# Altium project BLDC_ctrl.PrjPcb
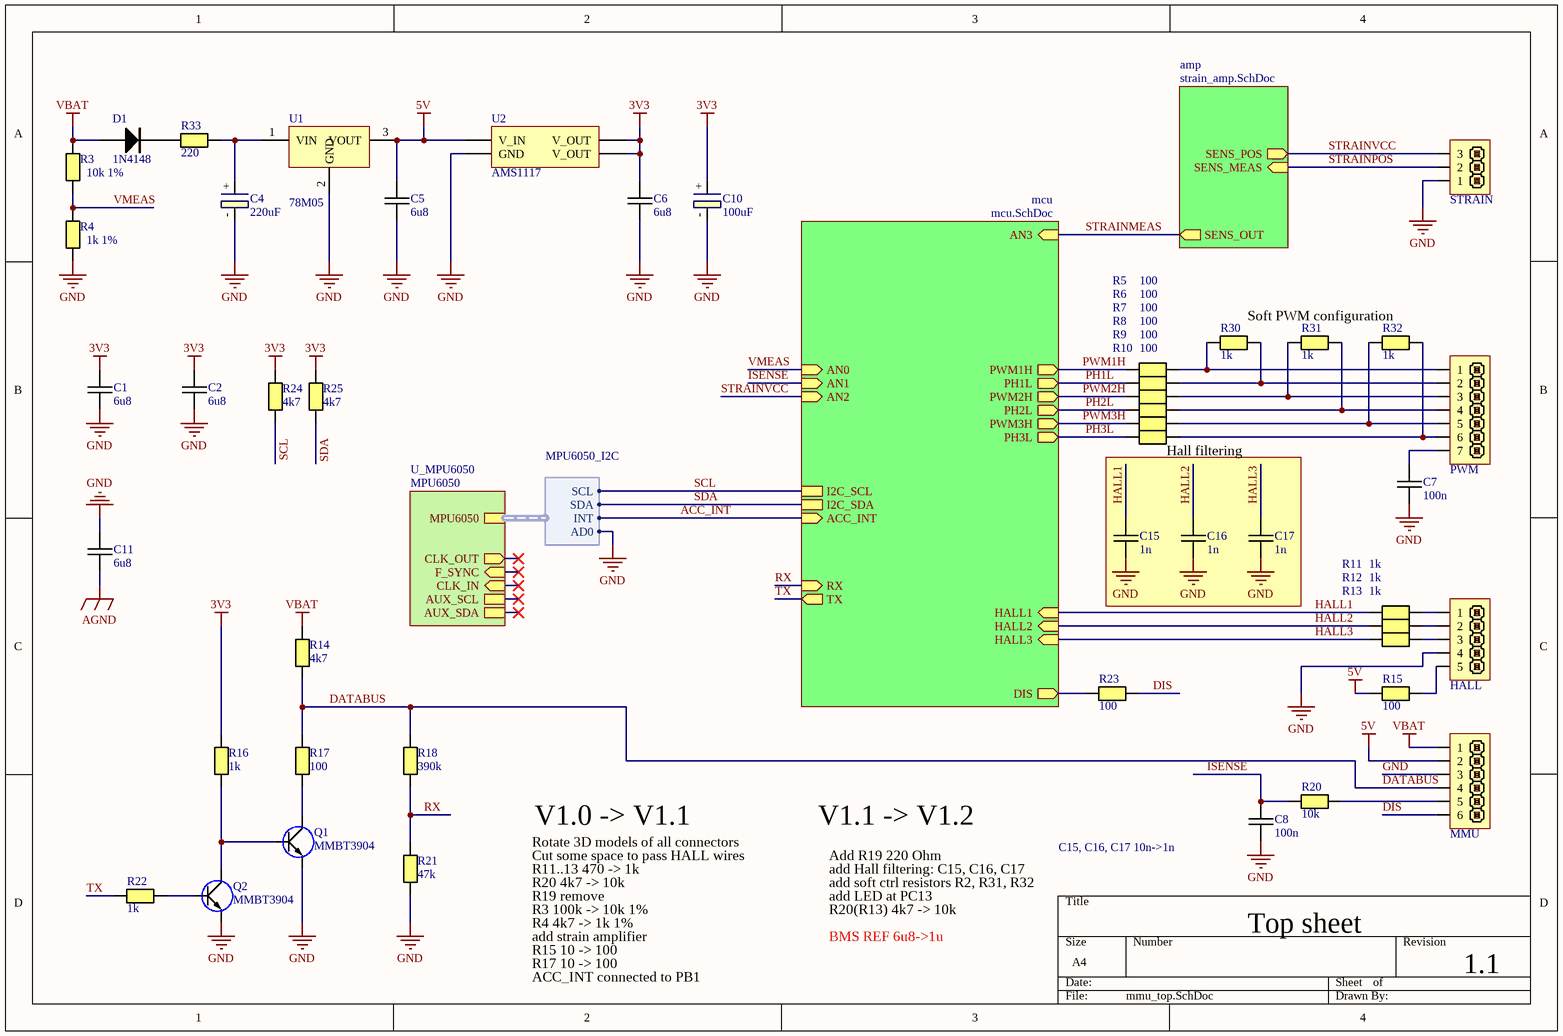
[diagram p0: mmu_top.SchDoc]
3 sheets, 64 parts. Net scope: hierarchical (ports join the sheet entries above them; power ports are global).
Board file: mmu_pcb_v1.2.PcbDoc
Sheets:
  mmu_top.SchDoc
    mcu = mcu.SchDoc
    amp = strain_amp.SchDoc

## Sheet mmu_top.SchDoc
size A4; SheetNumber: 1; SheetTotal: 4

### Parts
(Parts that share a designator on the sheet are numbered #1, #2 ... from top to bottom, then left to right.)
C1  6u8  [CAPC0805(2012)75_N]
C2  6u8  [CAPC0805(2012)75_N]
C4  220uF  [10x10.5 Capacitor]
C5  6u8  [CAPC0805(2012)75_N]
C6  6u8  [CAPC0805(2012)75_N]
C7  100n  [CAPC0603(1608)55_N]
C8  100n  [CAPC0603(1608)55_N]
C10  100uF  [TC7343]
C11  6u8  [CAPC0805(2012)75_N]
C15  1n  [CAPC0603(1608)55_N]
C16  1n  [CAPC0603(1608)55_N]
C17  1n  [CAPC0603(1608)55_N]
D1  1N4148  [SOD80]
HALL  PIN HEADER 1x5  [XH2.54 5P]  (value not drawn)
MMU  PIN HEADER 1x6  [XH2.54 6P]  (value not drawn)
PWM  PIN HEADER 1x7  [XH2.54 7P]  (value not drawn)
Q1  MMBT3904  [SOT23]
Q2  MMBT3904  [SOT23]
R3  10k 1%  [RESC0603(1608)_N]
R4  1k 1%  [RESC0603(1608)_N]
R5  100  [RESC0603(1608)_N]
R6  100  [RESC0603(1608)_N]
R7  100  [RESC0603(1608)_N]
R8  100  [RESC0603(1608)_N]
R9  100  [RESC0603(1608)_N]
R10  100  [RESC0603(1608)_N]
R11  1k  [RESC0603(1608)_N]
R12  1k  [RESC0603(1608)_N]
R13  1k  [RESC0603(1608)_N]
R14  4k7  [RESC0603(1608)_N]
R15  100  [RESC0603(1608)_N]
R16  1k  [RESC0603(1608)_N]
R17  100  [RESC0603(1608)_N]
R18  390k  [RESC0603(1608)_N]
R20  10k  [RESC0603(1608)_N]
R21  47k  [RESC0603(1608)_N]
R22  1k  [RESC0603(1608)_N]
R23  100  [RESC0603(1608)_N]
R24  4k7  [RESC0603(1608)_N]
R25  4k7  [RESC0603(1608)_N]
R30#1  1k  [RESC0603(1608)_N]
R31  1k  [RESC0603(1608)_N]
R32  1k  [RESC0603(1608)_N]
R33  220  [RESC2512(6432)_N]
STRAIN  PIN HEADER 1x3  [XH2.54 3P]  (value not drawn)
U1  78M05  [TO-252]
U2  AMS1117  [SOT229P700X180-4N]

### Blocks framed on the sheet
Hall filtering: C15-C17

### Sub-sheets
amp = strain_amp.SchDoc: SENS_OUT (out), SENS_POS (out), SENS_MEAS (in)
mcu = mcu.SchDoc: PWM1H (out), PWM3H (out), PH3L (out), PWM2H (out), DIS (out), PH2L (out), PH1L (out), RX (in), TX (out), AN2 (in), AN1 (in), HALL3 (in), AN3 (in), HALL2 (in), AN0 (in), HALL1 (in), I2C_SCL, I2C_SDA, ACC_INT (in)
U_MPU6050 = MPU6050 (file not in this document): MPU6050 (harness MPU6050_I2C), CLK_OUT (out), F_SYNC (in), CLK_IN (in), AUX_SCL, AUX_SDA

### Harnesses
MPU6050_I2C: AD0, INT, SCL, SDA

### Nets
3V3: C1.1 C2.1 C6.1 C10.+ R16.2 R24.2 R25.2 U2.2(V_OUT) U2.4(V_OUT)
5V: C5.1 MMU.2 R15.1 U1.3(VOUT) U2.3(V_IN)
AGND: C11.2
GND: C1.2 C2.2 C4.- C5.2 C6.2 C7.2 C8.2 C10.- C11.1 C15.2 C16.2 C17.2 HALL.4 MMU.3 Q1.2(E) Q2.2(E) R4.1 R21.1 STRAIN.1 U1.2(GND) U2.1(GND) ; sheet U_MPU6050/MPU6050.AD0
VBAT: D1.1(A) MMU.1 R3.2 R14.2
ACC_INT: sheet mcu/ACC_INT, sheet U_MPU6050/MPU6050.INT
DATABUS: MMU.4 R14.1 R17.2 R18.2
DIS: MMU.6 R23.2
HALL1: C15.1 R11.1 ; sheet mcu/HALL1
HALL2: C16.1 R12.1 ; sheet mcu/HALL2
HALL3: C17.1 R13.1 ; sheet mcu/HALL3
ISENSE: C8.1 R20.1 ; sheet mcu/AN1
PH1L: R6.1 ; sheet mcu/PH1L
PH2L: R8.1 ; sheet mcu/PH2L
PH3L: R10.1 ; sheet mcu/PH3L
PWM1H: R5.1 ; sheet mcu/PWM1H
PWM2H: R7.1 ; sheet mcu/PWM2H
PWM3H: R9.1 ; sheet mcu/PWM3H
RX: R18.1 R21.2 ; sheet mcu/RX
SCL: R24.1 ; sheet mcu/I2C_SCL, sheet U_MPU6050/MPU6050.SCL
SDA: R25.1 ; sheet mcu/I2C_SDA, sheet U_MPU6050/MPU6050.SDA
STRAINMEAS: sheet mcu/AN3, sheet amp/SENS_OUT  [project net OP_OUT_F]
STRAINPOS: STRAIN.2 ; sheet amp/SENS_MEAS  [project net SENS_MEAS]
STRAINVCC: STRAIN.3 ; sheet mcu/AN2, sheet amp/SENS_POS  [project net SENS_POS]
TX: R22.1 ; sheet mcu/TX
VMEAS: R3.1 R4.2 ; sheet mcu/AN0
NetC4_+: C4.+ R33.2 U1.1(VIN)
NetC7_1: C7.1 PWM.7
NetD1_2: D1.2(K) R33.1
NetHALL_1: HALL.1 R11.2
NetHALL_2: HALL.2 R12.2
NetHALL_3: HALL.3 R13.2
NetHALL_5: HALL.5 R15.2
NetMMU_5: MMU.5 R20.2
NetPWM_1: PWM.1 R5.2 R30#1.1
NetPWM_2: PWM.2 R6.2 R30#1.2
NetPWM_3: PWM.3 R7.2 R31.1
NetPWM_4: PWM.4 R8.2 R31.2
NetPWM_5: PWM.5 R9.2 R32.1
NetPWM_6: PWM.6 R10.2 R32.2
NetQ1_1: Q1.1(B) Q2.3(C) R16.1
NetQ1_3: Q1.3(C) R17.1
NetQ2_1: Q2.1(B) R22.2
NetR23_1: R23.1 ; sheet mcu/DIS

### Notes on the sheet
- Soft PWM configuration
- Rotate 3D models of all connectors
- Cut some space to pass HALL wires
- V1.0 -> V1.1
- Add R19 220 Ohm
- V1.1 -> V1.2
- C15, C16, C17 10n->1n
- R11..13 470 -> 1k
- R20 4k7 -> 10k
- R19 remove
- R3 100k -> 10k 1%
- R4 4k7 -> 1k 1%
- add Hall filtering: C15, C16, C17
- add soft ctrl resistors R2, R31, R32
- add LED at PC13
- R20(R13) 4k7 -> 10k
- Top sheet
- add strain amplifier
- R15 10 -> 100
- R17 10 -> 100
- ACC_INT connected to PB1
- BMS REF 6u8->1u
- 1.1

### Library data of the parts
C1 C2 C5-C8 C11 C15-C17 = Capacitor M: Ceramic capacitor Medium density
  C1 C2 C5 C6 C11: Value: 6u8
  C7 C8: Value: 100n
  C15-C17: Value: 1n
C4 C10 = Capacitor Electrolitic
  C4: Value: 220uF
  C10: Value: 100uF
D1 = 1N4148: Small Signal Fast Switching Diodes; Repetitive peak reverse voltage: 100 V; Reverse voltage: 75 V; Peak forward surge current: 2 A; Repetitive peak forward current: 500 mA; Forward continuous current: 300 mA; Average forward current: 150 mA; Diode capacitance: 4 pF; Reverse recovery time: 4 ~ 8 ns; Supplier 1: Mouser; Supplier Part Number 1: 78-MCL4148
HALL = PIN HEADER 2.54 1x5
MMU = PIN HEADER 2.54 1x6
PWM = PIN HEADER 2.54 1x7
Q1 Q2 = 2N3904: NPN General Purpose Transistor; Collector-Emitter Voltage: 40V; Collector-Base Voltage: 60V; Collector Current - Continuous: 200mA; DC Current Gain: 300
R3-R18 R20-R25 R30#1 R31-R33 = Resistor M: Resistor Medium Density
  R3: Value: 10k 1%
  R4: Value: 1k 1%
  R5-R10 R15 R17 R23: Value: 100
  R11-R13 R16 R22 R30#1 R31 R32: Value: 1k
  R14 R24 R25: Value: 4k7
  R18: Value: 390k
  R20: Value: 10k
  R21: Value: 47k
  R33: Value: 220
STRAIN = PIN HEADER 2.54 1x3
U1 = 78M05: Linear Voltage Regulator; DC Input Voltage MAX: 30V; Output Current: 300..700mA
U2 = AMS1117: 800mA LDO  15V max

## Sheet mcu.SchDoc
size A4; SheetNumber: 2; SheetTotal: 4
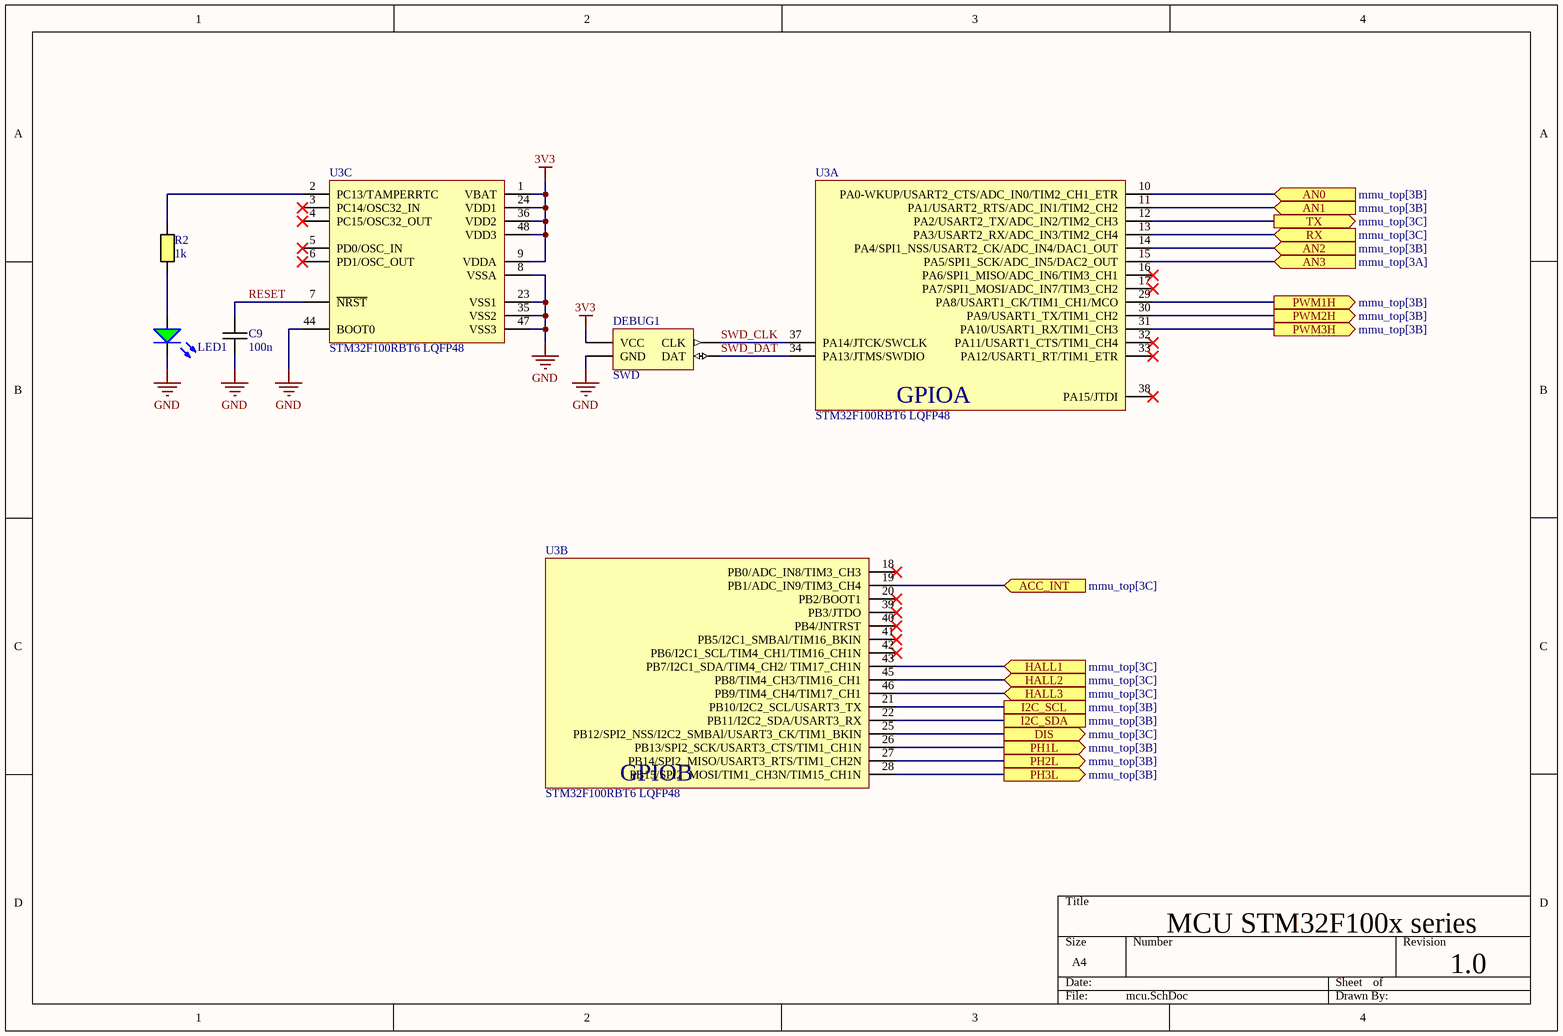
[diagram p1: mcu.SchDoc]

### Parts
C9  100n  [CAPC0603(1608)55_N]
DEBUG1  SWD  [PIN HEADER SINGLE 4]
LED1  1206 LED GREEN  [1206 LED GREEN]  (value not drawn)
R2  1k  [RESC0603(1608)_N]
U3  STM32F100RBT6 LQFP48  [LQFP48]  (parts A,B,C of 3)

### Ports
ACC_INT (in, see mmu_top[3C]), AN0 (in, see mmu_top[3B]), AN1 (in, see mmu_top[3B]), AN2 (in, see mmu_top[3B]), AN3 (in, see mmu_top[3A]), DIS (out, see mmu_top[3C]), HALL1 (in, see mmu_top[3C]), HALL2 (in, see mmu_top[3C]), HALL3 (in, see mmu_top[3C]), I2C_SCL (see mmu_top[3B]), I2C_SDA (see mmu_top[3B]), PH1L (out, see mmu_top[3B]), PH2L (out, see mmu_top[3B]), PH3L (out, see mmu_top[3B]), PWM1H (out, see mmu_top[3B]), PWM2H (out, see mmu_top[3B]), PWM3H (out, see mmu_top[3B]), RX (in, see mmu_top[3C]), TX (out, see mmu_top[3C])

### Nets
3V3: DEBUG1.1(VCC) U3.1(VBAT) U3.9(VDDA) U3.24(VDD1) U3.36(VDD2) U3.48(VDD3)
GND: C9.2 DEBUG1.3(GND) LED1.K U3.8(VSSA) U3.23(VSS1) U3.35(VSS2) U3.44(BOOT0) U3.47(VSS3)
ACC_INT: U3.19(PB1/ADC_IN9/TIM3_CH4) ; port ACC_INT
HALL1: U3.43(PB7/I2C1_SDA/TIM4_CH2/_TIM17_CH1N) ; port HALL1
HALL2: U3.45(PB8/TIM4_CH3/TIM16_CH1) ; port HALL2
HALL3: U3.46(PB9/TIM4_CH4/TIM17_CH1) ; port HALL3
ISENSE: U3.11(PA1/USART2_RTS/ADC_IN1/TIM2_CH2) ; port AN1
OP_OUT_F: U3.15(PA5/SPI1_SCK/ADC_IN5/DAC2_OUT) ; port AN3
PH1L: U3.26(PB13/SPI2_SCK/USART3_CTS/TIM1_CH1N) ; port PH1L
PH2L: U3.27(PB14/SPI2_MISO/USART3_RTS/TIM1_CH2N) ; port PH2L
PH3L: U3.28(PB15/SPI2_MOSI/TIM1_CH3N/TIM15_CH1N) ; port PH3L
PWM1H: U3.29(PA8/USART1_CK/TIM1_CH1/MCO) ; port PWM1H
PWM2H: U3.30(PA9/USART1_TX/TIM1_CH2) ; port PWM2H
PWM3H: U3.31(PA10/USART1_RX/TIM1_CH3) ; port PWM3H
RESET: C9.1 U3.7(~{NRST})
RX: U3.13(PA3/USART2_RX/ADC_IN3/TIM2_CH4) ; port RX
SCL: U3.21(PB10/I2C2_SCL/USART3_TX) ; port I2C_SCL
SDA: U3.22(PB11/I2C2_SDA/USART3_RX) ; port I2C_SDA
SENS_POS: U3.14(PA4/SPI1_NSS/USART2_CK/ADC_IN4/DAC1_OUT) ; port AN2
SWD_CLK: DEBUG1.2(CLK) U3.37(PA14/JTCK/SWCLK)
SWD_DAT: DEBUG1.4(DAT) U3.34(PA13/JTMS/SWDIO)
TX: U3.12(PA2/USART2_TX/ADC_IN2/TIM2_CH3) ; port TX
VMEAS: U3.10(PA0-WKUP/USART2_CTS/ADC_IN0/TIM2_CH1_ETR) ; port AN0
NetLED1_A: LED1.A R2.1
NetR2_2: R2.2 U3.2(PC13/TAMPERRTC)
NetR23_1: U3.25(PB12/SPI2_NSS/I2C2_SMBAl/USART3_CK/TIM1_BKIN) ; port DIS

Not connected (* = marked no-connect by the designer): U3 3(PC14/OSC32_IN)* 4(PC15/OSC32_OUT)* 5(PD0/OSC_IN)* 6(PD1/OSC_OUT)* 16(PA6/SPI1_MISO/ADC_IN6/TIM3_CH1)* 17(PA7/SPI1_MOSI/ADC_IN7/TIM3_CH2)* 18(PB0/ADC_IN8/TIM3_CH3)* 20(PB2/BOOT1)* 32(PA11/USART1_CTS/TIM1_CH4)* 33(PA12/USART1_RT/TIM1_ETR)* 38(PA15/JTDI)* 39(PB3/JTDO)* 40(PB4/JNTRST)* 41(PB5/I2C1_SMBAl/TIM16_BKIN)* 42(PB6/I2C1_SCL/TIM4_CH1/TIM16_CH1N)*

### Notes on the sheet
- MCU STM32F100x series
- 1.0
- (in symbol STM32F100RBT6 LQFP48, part A) GPIOA
- (in symbol STM32F100RBT6 LQFP48, part B) GPIOB

### Library data of the parts
C9 = Capacitor M: Ceramic capacitor Medium density; Value: 100n
DEBUG1 = SWD DEBUG: SWD ST DEBUG
R2 = Resistor M: Resistor Medium Density; Value: 1k

## Sheet strain_amp.SchDoc
size A4; SheetNumber: 3; SheetTotal: 4
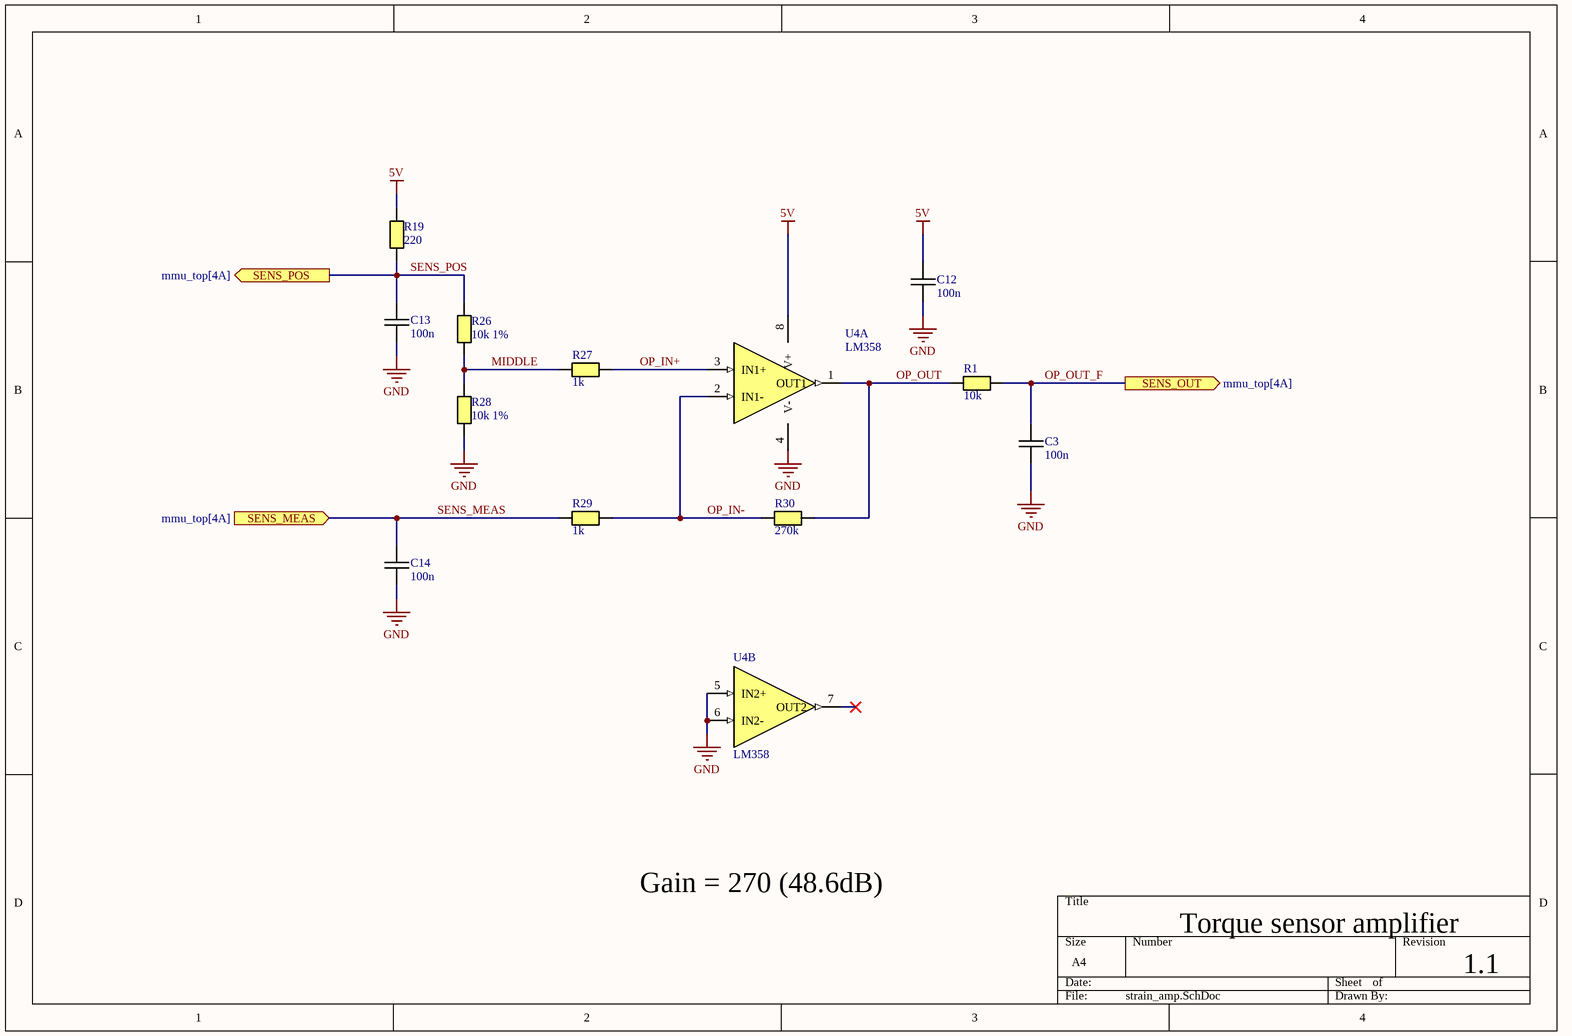
[diagram p2: strain_amp.SchDoc]

### Parts
(Parts that share a designator on the sheet are numbered #1, #2 ... from top to bottom, then left to right.)
C3  100n  [CAPC0603(1608)55_N]
C12  100n  [CAPC0603(1608)55_N]
C13  100n  [CAPC0603(1608)55_N]
C14  100n  [CAPC0603(1608)55_N]
R1  10k  [RESC0603(1608)_N]
R19  220  [RESC0603(1608)_N]
R26  10k 1%  [RESC0603(1608)_N]
R27  1k  [RESC0603(1608)_N]
R28  10k 1%  [RESC0603(1608)_N]
R29  1k  [RESC0603(1608)_N]
R30#2  270k  [RESC0603(1608)_N]
U4  LM358  [SO8]  (parts A,B of 2)

### Ports
SENS_MEAS (in, see mmu_top[4A]), SENS_OUT (out, see mmu_top[4A]), SENS_POS (out, see mmu_top[4A])

### Nets
5V: C12.1 R19.2 U4.8(V+)
GND: C3.2 C12.2 C13.2 C14.2 R28.1 U4.4(V-) U4.5(IN2+) U4.6(IN2-)
MIDDLE: R26.1 R27.1 R28.2
OP_IN+: R27.2 U4.3(IN1+)
OP_IN-: R29.2 R30#2.1 U4.2(IN1-)
OP_OUT: R1.1 R30#2.2 U4.1(OUT1)
OP_OUT_F: C3.1 R1.2 ; port SENS_OUT
SENS_MEAS: C14.1 R29.1 ; port SENS_MEAS
SENS_POS: C13.1 R19.1 R26.2 ; port SENS_POS

Not connected (* = marked no-connect by the designer): U4 7(OUT2)*

### Notes on the sheet
- Gain = 270 (48.6dB)
- Torque sensor amplifier
- 1.1

### Library data of the parts
C3 C12-C14 = Capacitor M: Ceramic capacitor Medium density; Value: 100n
R1 R19 R26-R29 R30#2 = Resistor M: Resistor Medium Density
  R1: Value: 10k
  R19: Value: 220
  R26 R28: Value: 10k 1%
  R27 R29: Value: 1k
  R30#2: Value: 270k

## Nets that join several sheets
3V3: mmu_top (9 pins), mcu (6 pins)
5V: mmu_top (5 pins), strain_amp (C12.1 R19.2 U4.8)
GND: mmu_top (21 pins), mcu (8 pins), strain_amp (8 pins)
HALL1: mmu_top (C15.1 R11.1), mcu (U3.43)
HALL2: mmu_top (C16.1 R12.1), mcu (U3.45)
HALL3: mmu_top (C17.1 R13.1), mcu (U3.46)
ISENSE: mmu_top (C8.1 R20.1), mcu (U3.11)
NetR23_1: mmu_top (R23.1), mcu (U3.25)
OP_OUT_F: mcu (U3.15), strain_amp (C3.1 R1.2)
PH1L: mmu_top (R6.1), mcu (U3.26)
PH2L: mmu_top (R8.1), mcu (U3.27)
PH3L: mmu_top (R10.1), mcu (U3.28)
PWM1H: mmu_top (R5.1), mcu (U3.29)
PWM2H: mmu_top (R7.1), mcu (U3.30)
PWM3H: mmu_top (R9.1), mcu (U3.31)
RX: mmu_top (R18.1 R21.2), mcu (U3.13)
SCL: mmu_top (R24.1), mcu (U3.21)
SDA: mmu_top (R25.1), mcu (U3.22)
SENS_MEAS: mmu_top (STRAIN.2), strain_amp (C14.1 R29.1)
SENS_POS: mmu_top (STRAIN.3), mcu (U3.14), strain_amp (C13.1 R19.1 R26.2)
TX: mmu_top (R22.1), mcu (U3.12)
VMEAS: mmu_top (R3.1 R4.2), mcu (U3.10)